# Altium schematic sheet 05 MICROSD.SchDoc
size A4
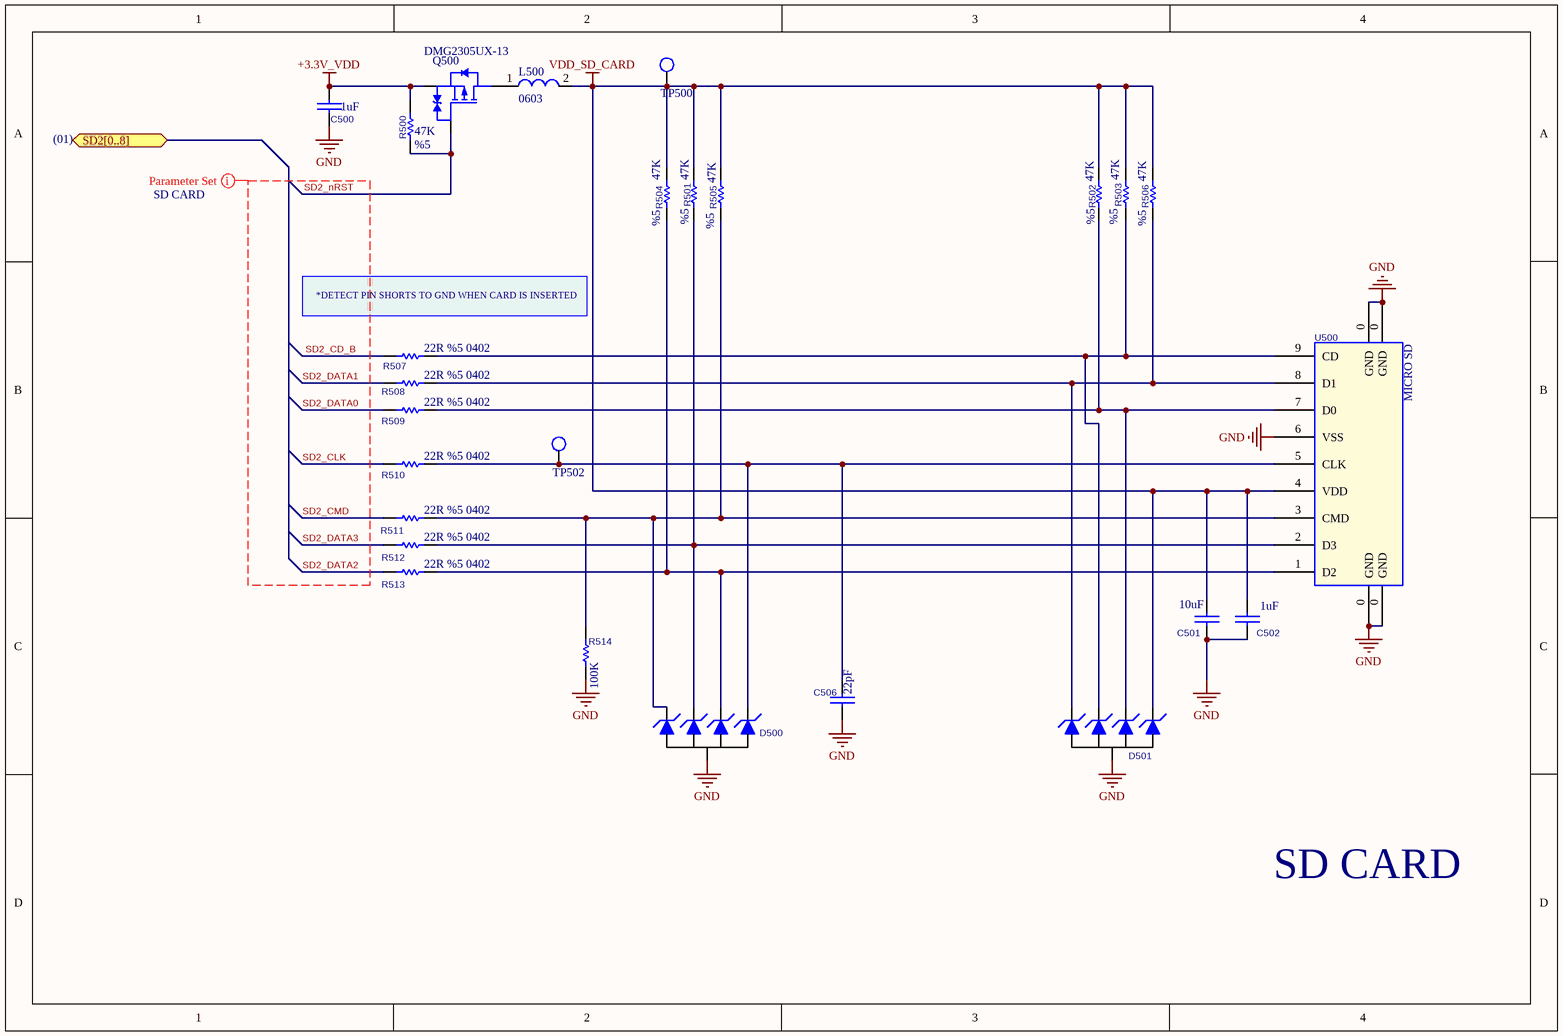
[diagram p0: 05 MICROSD.SchDoc]

## Parts
C500  1uF  [0603_CC]
C501  10uF  [0603_CC]
C502  1uF  [0603_CC]
C506  22pF  [0402_CC]
D500  DIODE-DF5A6.2LJE,LM  [DF5A6.2LJE,LM]  (value not drawn)
D501  DIODE-DF5A6.2LJE,LM  [DF5A6.2LJE,LM]  (value not drawn)
L500  0603  [0603_RES]
Q500  DMG2305UX-13  [SOT23]
R500  47K  Tolerance: %5  [0402_RES]
R501  47K  Tolerance: %5  [0402_RES]
R502  47K  Tolerance: %5  [0402_RES]
R503  47K  Tolerance: %5  [0402_RES]
R504  47K  Tolerance: %5  [0402_RES]
R505  47K  Tolerance: %5  [0402_RES]
R506  47K  Tolerance: %5  [0402_RES]
R507  22R %5 0402  [0402_RES]
R508  22R %5 0402  [0402_RES]
R509  22R %5 0402  [0402_RES]
R510  22R %5 0402  [0402_RES]
R511  22R %5 0402  [0402_RES]
R512  22R %5 0402  [0402_RES]
R513  22R %5 0402  [0402_RES]
R514  100K  [0402_RES]
TP500  TEST POINT 15  [testpoint_15]  (value not drawn)  (no BOM)
TP502  TEST POINT 15  [testpoint_15]  (value not drawn)  (no BOM)
U500  MICRO SD  [L-KLS1-TF-003-H1.85-R]

## Ports
SD2[0..8] (bidir)

## Nets
+3.3V_VDD: C500.1 Q500.2(S) R500.2
GND: C500.2 C501.2 C502.2 C506.2 D500.2 D501.2 R514.1 U500.0(GND) U500.6(VSS)
VDD_SD_CARD: C501.1 C502.1 D501.5 L500.2 R501.2 R502.2 R503.2 R504.2 R505.2 R506.2 TP500.1 U500.4(VDD)
SD2_CD_B: R507.1
SD2_CLK: R510.1
SD2_CMD: R511.1
SD2_DATA0: R509.1
SD2_DATA1: R508.1
SD2_DATA2: R513.1
SD2_DATA3: R512.1
SD2_nRST: Q500.1(G) R500.1
NetC506_1: C506.1 D500.5 R510.2 TP502.1 U500.5(CLK)
NetD500_1: D500.1 R505.1 R511.2 R514.2 U500.3(CMD)
NetD500_3: D500.3 R501.1 R512.2 U500.2(D3)
NetD500_4: D500.4 R504.1 R513.2 U500.1(D2)
NetD501_1: D501.1 R506.1 R508.2 U500.8(D1)
NetD501_3: D501.3 R503.1 R507.2 U500.9(CD)
NetD501_4: D501.4 R502.1 R509.2 U500.7(D0)
NetL500_1: L500.1 Q500.3(D)

## Layout directives
net class SD CARD: SD2_CD_B, SD2_CLK, SD2_CMD, SD2_DATA0, SD2_DATA1, SD2_DATA2, SD2_DATA3, SD2_nRST

## Notes on the sheet
- (01)
- *DETECT PIN SHORTS TO GND WHEN CARD IS INSERTED
- SD CARD
- Sheet Title:
- Inventron
- Size:
- Drawn By:
- Revision:
- Project:
- Checked By:
- A4
- Sheet
- of
- Budotek Teknopark
- Dudullu OSB
- Des 2. Cadde No:8/30
- Umraniye / ISTANBUL
- Electronics and Software
- Date:
- Time:
- ©2020 Inventron Electronics and Software. All rights reserved.

## Library data of the parts
C500 C502 = CAP-CL10B105KA8NNNC: CAP CER 1UF 25V X7R 0603; Manufacturer-1: SAMSUNG; Class: Capacitor; Manufacturer Part Number-1: CL10B105KA8NNNC; Footprint: *; Manufacturer-2: *; Manufacturer Part Number-2: *; Inventron Stock No: *; Created By: LA; Created Date: *; Checked By: *; ASSY_OPT: *; Dimensions: *; Unit Price: *; Revision Date/Note: *; Price Break: *; Opt. Temp.: *; Features: *
C501 = CAP-JMK107BC6106MA-T: CAP CER 10UF 6.3V X6S 0603; Manufacturer-1: TAIYO YUDEN; Opt. Temp.: -55/+105; Class: Capacitor; Manufacturer Part Number-1: JMK107BC6106MA-T; Footprint: 0603; Manufacturer-2: *; Manufacturer Part Number-2: *; Inventron Stock No: *; Created By: LA; Created Date: 23.11.2018; Checked By: *; ASSY_OPT: *; Dimensions: *; Unit Price: 0,044; Revision Date/Note: *; Price Break: 4K
C506 = CAP-C0402C220K5GACTU: CAP CER 22PF 50V C0G/NPO 0402; Manufacturer-1: KEMET; Opt. Temp.: -55/+125; Class: Capacitor; Manufacturer Part Number-1: C0402C220K5GACTU; Footprint: 0402; Manufacturer-2: *; Manufacturer Part Number-2: *; Inventron Stock No: *; Created By: LA; Created Date: 23.11.2018; Checked By: *; ASSY_OPT: *; Dimensions: *; Unit Price: 0,00420; Revision Date/Note: *; Price Break: 10K
D500 D501 = DIODE-DF5A6.2LJE,LM: TVS DIODE 5V 4CH SOT-553; Manufacturer-1: TOSHIBA; Manufacturer Part Number-1: DF5A6.2LJE,LM; Footprint: *; Manufacturer-2: *; Manufacturer Part Number-2: *; Inventron Stock No: *; Created By: OKS; Created Date: 29.03.2019; Checked By: *; ASSY_OPT: *; Dimensions: *; Unit Price: *; Revision Date/Note: *; Price Break: *; Opt. Temp.: *; Class: Diode
L500 = IND-FERRITE (RES 0 OHM) 0603: 0OHM 0603; Manufacturer Part Number-1: RC0603JR-070RL; Manufacturer-1: YAGEO; Class: Inductor; Footprint: 0603; Manufacturer-2: *; Inventron Stock No: *; Created By: EE; Checked By: *; ASSY_OPT: *; Dimensions: *; Revision Date/Note: *
Q500 = MOS-DMG2305UX-13: MOSFET P-CH 20V 4.2A SOT23; Manufacturer-1: Diodes Incorporated; Class: Transistor; Manufacturer Part Number-1: DMG2305UX-13; Manufacturer-2: *; Manufacturer Part Number-2: *; Inventron Stock No: *; Created By: EE; Created Date: *; Checked By: *; ASSY_OPT: *; Dimensions: *; Unit Price: 0.072D; Revision Date/Note: *; Price Break: *; Opt. Temp.: *; Features: *
R500-R506 = RES-47K: RES 47K OHM 5% 1/16W 0402; Manufacturer Part Number-1: MCR01MZPJ473; Opt. Temp.: -55/+155; Class: Resistor; Footprint: 0402; Manufacturer-2: *; Manufacturer Part Number-2: *; Inventron Stock No: *; Created By: LA; Checked By: *; ASSY_OPT: *; Dimensions: *; Revision Date/Note: *
R507-R513 = RES- RC0402JR-0722RL.: RES, THICK FILM, 22R, 5%, 0.0625W, 0402, REEL; Manufacturer-1: YAGEO; Class: Resistor; Manufacturer Part Number-1: RC0402JR-0722RL.; Footprint: 0402; Manufacturer-2: *; Manufacturer Part Number-2: *; Inventron Stock No: *; Created By: E.E; Created Date: 22.10.2020; Checked By: *; ASSY_OPT: *; Dimensions: *; Unit Price: *; Revision Date/Note: *; Price Break: *; Opt. Temp.: *; Tolerance: *
R514 = RES-RMCF0402JT100K: RES 100K OHM 5% 1/16W 0402; Manufacturer-1: STACKPOLE; Opt. Temp.: -55/+155; Class: Resistor; Tolerance: %5; Manufacturer Part Number-1: RMCF0402JT100K; Footprint: 0402; Manufacturer-2: *; Manufacturer Part Number-2: *; Inventron Stock No: *; Created By: LA; Created Date: 23.11.2018; Checked By: *; ASSY_OPT: *; Dimensions: *; Unit Price: 0,00127; Revision Date/Note: *; Price Break: 10K; Features: AUTOMOTIVE
U500 = CON-L-KLS1-TF-003-H1.85-R: CONECTOR MICRO SD CARD SMD KLS; Opt. Temp.: -25/+90; Class: Connector; Manufacturer Part Number-1: L-KLS1-TF-003-H1.85-R; Footprint: *; Manufacturer-1: KLS; Manufacturer-2: *; Manufacturer Part Number-2: *; Inventron Stock No: *; Created By: LA; Created Date: 19.04.2019; Checked By: *; ASSY_OPT: *; Dimensions: *; Unit Price: 0,2299; Revision Date/Note: *; Price Break: 1000